# Altium schematic sheet TPS54302-4V.SchDoc: TPS54302-4V
size A4; CompanyName: github.com/aKaReZa75; Revision: 1.0; Project_Name: Design Template
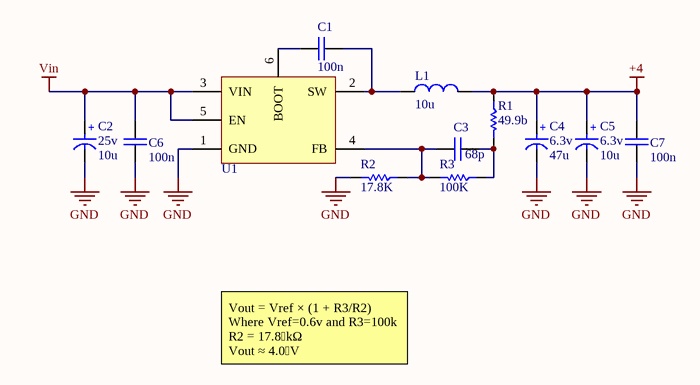
[diagram p0: TPS54302-4V.SchDoc]

## Parts
C1  100n  [CAP 0805/2012]
C2  Rating: 25v  [SMT_C_Tantalum_B]  (hidden comment: 10u)
C3  68p  [CAP 0805/2012]
C4  Rating: 6.3v  [SMT_C_Tantalum_B]  (hidden comment: 47u)
C5  Rating: 6.3v  [SMT_C_Tantalum_A]  (hidden comment: 10u)
C6  100n  [CAP 1206/3216]
C7  100n  [CAP 1206/3216]
L1  10u  [L_7]
R1  49.9b  [RES 0805 (2012X06L)]
R2  17.8K  [RES 0805 (2012X06L)]
R3  100K  [RES 0805 (2012X06L)]
U1  Value?  [TPS54302]  (value not drawn)

## Nets
+4: C4.1(+) C5.1(+) C7.1 L1.2 R1.1
GND: C2.2(-) C4.2(-) C5.2(-) C6.2 C7.2 R2.2 U1.1(GND)
Vin: C2.1(+) C6.1 U1.3(VIN) U1.5(EN)
NetC1_1: C1.1 U1.6(BOOT)
NetC1_2: C1.2 L1.1 U1.2(SW)
NetC3_1: C3.1 R2.1 R3.2 U1.4(FB)
NetC3_2: C3.2 R1.2 R3.1

## Notes on the sheet
- Vout = Vref × (1 + R3/R2)
  Where Vref=0.6v and R3=100k
  R2 = 17.8 kΩ
  Vout ≈ 4.0 V
- Title:
- Project:
- Drawn by:
- Revision:
- Hossein Bagheri
- Company:
- Sheet
- of

## Library data of the parts
C1 = Cap_Multi_SMD_100nF_0805: Bipolar ceramic capacitor SMD; Inflow: inflow?; Type: MultiLayer; Rating: 50V; Validation: Valid; Package: 0805; Value: 100n
C2 C4 C5 = Cap_Tantalum: Tantalum Capacitor,TAJ Series-SMD; Inflow: inflow?; Validation: Valid; Package: Package?; Type: Tantalum
  C2 C5: Value: 10u
  C4: Value: 47u
C3 = Cap_Multi_SMD_0805: Bipolar ceramic capacitor SMD; Inflow: inflow?; Type: MultiLayer; Rating: Rating?; Validation: Valid; Package: 0805; Value: 68p
C6 C7 = Cap_Multi_SMD_100nF_1206: Bipolar ceramic capacitor SMD; Type: MultiLayer; Inflow: inflow?; Rating: 50V; Validation: Valid; Package: 1206; Value: 100n
L1 = Ind_SMD: Inductor; Inflow: inflow?; Type: Type?; Rating: 3.8A; Validation: Valid; Package: Package?; Value: 10u
R1-R3 = Res_SMD_0805: Resistor; Inflow: inflow?; Rating: 0.125W; Validation: Valid; Package: 0805; Type: 1%
  R1: Value: 49.9b
  R2: Value: 17.8K
  R3: Value: 100K
U1 = IC_Reg_TPS54302: 3'A Synchronous Step-Down Converter; Rating: S; Inflow: inflow?; Validation: Valid; Value: Value?; Type: Switching; Package: SOT-23-6